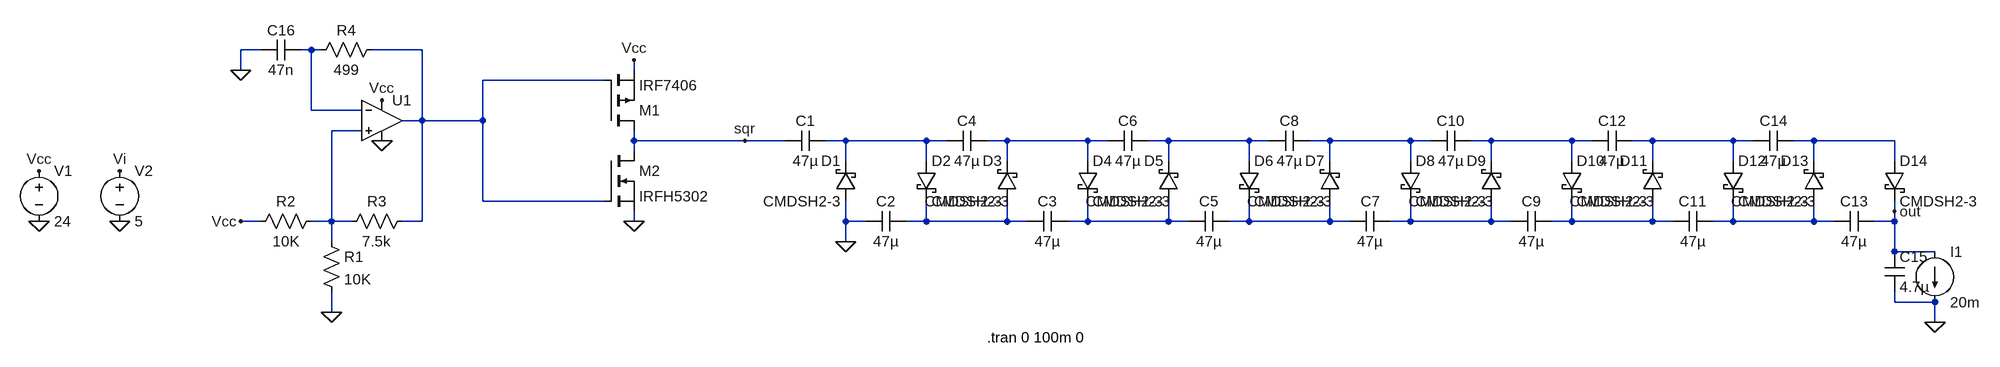
[diagram p0: schematic voltage_mult.asc]
voltage_mult.asc, the LTspice schematic file:
Version 4
SHEET 1 1904 680
WIRE -832 -176 -864 -176
WIRE -752 -176 -768 -176
WIRE -736 -176 -752 -176
WIRE -576 -176 -656 -176
WIRE -864 -144 -864 -176
WIRE -240 -144 -240 -160
WIRE -288 -128 -480 -128
WIRE -752 -80 -752 -176
WIRE -672 -80 -752 -80
WIRE -576 -64 -576 -176
WIRE -576 -64 -608 -64
WIRE -480 -64 -480 -128
WIRE -480 -64 -576 -64
WIRE -672 -48 -720 -48
WIRE -240 -32 -240 -48
WIRE -64 -32 -240 -32
WIRE 0 -32 -64 -32
WIRE 96 -32 64 -32
WIRE 224 -32 96 -32
WIRE 256 -32 224 -32
WIRE 352 -32 320 -32
WIRE 480 -32 352 -32
WIRE 512 -32 480 -32
WIRE 608 -32 576 -32
WIRE 736 -32 608 -32
WIRE 768 -32 736 -32
WIRE 864 -32 832 -32
WIRE 992 -32 864 -32
WIRE 1024 -32 992 -32
WIRE 1120 -32 1088 -32
WIRE 1248 -32 1120 -32
WIRE 1280 -32 1248 -32
WIRE 1376 -32 1344 -32
WIRE 1504 -32 1376 -32
WIRE 1536 -32 1504 -32
WIRE 1632 -32 1600 -32
WIRE 1760 -32 1632 -32
WIRE -240 -16 -240 -32
WIRE 96 0 96 -32
WIRE 224 0 224 -32
WIRE 352 0 352 -32
WIRE 480 0 480 -32
WIRE 608 0 608 -32
WIRE 736 0 736 -32
WIRE 864 0 864 -32
WIRE 992 0 992 -32
WIRE 1120 0 1120 -32
WIRE 1248 0 1248 -32
WIRE 1376 0 1376 -32
WIRE 1504 0 1504 -32
WIRE 1632 0 1632 -32
WIRE 1760 0 1760 -32
WIRE -480 64 -480 -64
WIRE -288 64 -480 64
WIRE 1760 80 1760 64
WIRE -832 96 -864 96
WIRE -720 96 -720 -48
WIRE -720 96 -752 96
WIRE -688 96 -720 96
WIRE -576 96 -576 -64
WIRE -576 96 -608 96
WIRE -240 96 -240 80
WIRE 96 96 96 64
WIRE 128 96 96 96
WIRE 224 96 224 64
WIRE 224 96 192 96
WIRE 352 96 352 64
WIRE 352 96 224 96
WIRE 384 96 352 96
WIRE 480 96 480 64
WIRE 480 96 448 96
WIRE 608 96 608 64
WIRE 608 96 480 96
WIRE 640 96 608 96
WIRE 736 96 736 64
WIRE 736 96 704 96
WIRE 864 96 864 64
WIRE 864 96 736 96
WIRE 896 96 864 96
WIRE 992 96 992 64
WIRE 992 96 960 96
WIRE 1120 96 1120 64
WIRE 1120 96 992 96
WIRE 1152 96 1120 96
WIRE 1248 96 1248 64
WIRE 1248 96 1216 96
WIRE 1376 96 1376 64
WIRE 1376 96 1248 96
WIRE 1408 96 1376 96
WIRE 1504 96 1504 64
WIRE 1504 96 1472 96
WIRE 1632 96 1632 64
WIRE 1632 96 1504 96
WIRE 1664 96 1632 96
WIRE 1760 96 1760 80
WIRE 1760 96 1728 96
WIRE -720 128 -720 96
WIRE 96 128 96 96
WIRE 1760 144 1760 96
WIRE 1824 144 1760 144
WIRE 1760 224 1760 208
WIRE 1824 224 1760 224
WIRE -720 240 -720 208
WIRE 1824 256 1824 224
FLAG -64 -32 sqr
FLAG 96 128 0
FLAG 1760 80 out
FLAG 1824 256 0
FLAG -720 240 0
FLAG -1056 96 0
FLAG -1056 16 Vi
FLAG -640 -96 Vcc
FLAG -640 -32 0
FLAG -864 -144 0
FLAG -864 96 Vcc
FLAG -1184 96 0
FLAG -1184 16 Vcc
FLAG -240 96 0
FLAG -240 -160 Vcc
SYMBOL cap 64 -48 R90
WINDOW 0 0 32 VBottom 2
WINDOW 3 32 32 VTop 2
SYMATTR InstName C1
SYMATTR Value 47µ
SYMBOL schottky 112 64 R180
WINDOW 0 24 64 Left 2
WINDOW 3 24 0 Left 2
SYMATTR InstName D1
SYMATTR Value CMDSH2-3
SYMBOL cap 192 80 R90
WINDOW 0 0 32 VBottom 2
WINDOW 3 32 32 VTop 2
SYMATTR InstName C2
SYMATTR Value 47µ
SYMBOL schottky 208 0 R0
SYMATTR InstName D2
SYMATTR Value CMDSH2-3
SYMBOL schottky 368 64 R180
WINDOW 0 24 64 Left 2
WINDOW 3 24 0 Left 2
SYMATTR InstName D3
SYMATTR Value CMDSH2-3
SYMBOL cap 448 80 R90
WINDOW 0 0 32 VBottom 2
WINDOW 3 32 32 VTop 2
SYMATTR InstName C3
SYMATTR Value 47µ
SYMBOL schottky 464 0 R0
SYMATTR InstName D4
SYMATTR Value CMDSH2-3
SYMBOL cap 320 -48 R90
WINDOW 0 0 32 VBottom 2
WINDOW 3 32 32 VTop 2
SYMATTR InstName C4
SYMATTR Value 47µ
SYMBOL schottky 624 64 R180
WINDOW 0 24 64 Left 2
WINDOW 3 24 0 Left 2
SYMATTR InstName D5
SYMATTR Value CMDSH2-3
SYMBOL cap 704 80 R90
WINDOW 0 0 32 VBottom 2
WINDOW 3 32 32 VTop 2
SYMATTR InstName C5
SYMATTR Value 47µ
SYMBOL schottky 720 0 R0
SYMATTR InstName D6
SYMATTR Value CMDSH2-3
SYMBOL cap 576 -48 R90
WINDOW 0 0 32 VBottom 2
WINDOW 3 32 32 VTop 2
SYMATTR InstName C6
SYMATTR Value 47µ
SYMBOL schottky 880 64 R180
WINDOW 0 24 64 Left 2
WINDOW 3 24 0 Left 2
SYMATTR InstName D7
SYMATTR Value CMDSH2-3
SYMBOL cap 960 80 R90
WINDOW 0 0 32 VBottom 2
WINDOW 3 32 32 VTop 2
SYMATTR InstName C7
SYMATTR Value 47µ
SYMBOL schottky 976 0 R0
SYMATTR InstName D8
SYMATTR Value CMDSH2-3
SYMBOL cap 832 -48 R90
WINDOW 0 0 32 VBottom 2
WINDOW 3 32 32 VTop 2
SYMATTR InstName C8
SYMATTR Value 47µ
SYMBOL schottky 1136 64 R180
WINDOW 0 24 64 Left 2
WINDOW 3 24 0 Left 2
SYMATTR InstName D9
SYMATTR Value CMDSH2-3
SYMBOL cap 1216 80 R90
WINDOW 0 0 32 VBottom 2
WINDOW 3 32 32 VTop 2
SYMATTR InstName C9
SYMATTR Value 47µ
SYMBOL schottky 1232 0 R0
SYMATTR InstName D10
SYMATTR Value CMDSH2-3
SYMBOL cap 1088 -48 R90
WINDOW 0 0 32 VBottom 2
WINDOW 3 32 32 VTop 2
SYMATTR InstName C10
SYMATTR Value 47µ
SYMBOL schottky 1392 64 R180
WINDOW 0 24 64 Left 2
WINDOW 3 24 0 Left 2
SYMATTR InstName D11
SYMATTR Value CMDSH2-3
SYMBOL cap 1472 80 R90
WINDOW 0 0 32 VBottom 2
WINDOW 3 32 32 VTop 2
SYMATTR InstName C11
SYMATTR Value 47µ
SYMBOL schottky 1488 0 R0
SYMATTR InstName D12
SYMATTR Value CMDSH2-3
SYMBOL cap 1344 -48 R90
WINDOW 0 0 32 VBottom 2
WINDOW 3 32 32 VTop 2
SYMATTR InstName C12
SYMATTR Value 47µ
SYMBOL schottky 1648 64 R180
WINDOW 0 24 64 Left 2
WINDOW 3 24 0 Left 2
SYMATTR InstName D13
SYMATTR Value CMDSH2-3
SYMBOL cap 1728 80 R90
WINDOW 0 0 32 VBottom 2
WINDOW 3 32 32 VTop 2
SYMATTR InstName C13
SYMATTR Value 47µ
SYMBOL schottky 1744 0 R0
SYMATTR InstName D14
SYMATTR Value CMDSH2-3
SYMBOL cap 1600 -48 R90
WINDOW 0 0 32 VBottom 2
WINDOW 3 32 32 VTop 2
SYMATTR InstName C14
SYMATTR Value 47µ
SYMBOL cap 1744 144 R0
SYMATTR InstName C15
SYMATTR Value 4.7µ
SYMBOL current 1824 144 R0
WINDOW 123 0 0 Left 0
WINDOW 39 0 0 Left 0
SYMATTR InstName I1
SYMATTR Value 20m
SYMBOL res -736 112 R0
SYMATTR InstName R1
SYMATTR Value 10K
SYMBOL res -736 80 R90
WINDOW 0 0 56 VBottom 2
WINDOW 3 32 56 VTop 2
SYMATTR InstName R2
SYMATTR Value 10K
SYMBOL res -592 80 R90
WINDOW 0 0 56 VBottom 2
WINDOW 3 32 56 VTop 2
SYMATTR InstName R3
SYMATTR Value 7.5k
SYMBOL voltage -1056 0 R0
SYMATTR InstName V2
SYMATTR Value 5
SYMBOL res -640 -192 R90
WINDOW 0 0 56 VBottom 2
WINDOW 3 32 56 VTop 2
SYMATTR InstName R4
SYMATTR Value 499
SYMBOL cap -768 -192 R90
WINDOW 0 0 32 VBottom 2
WINDOW 3 32 32 VTop 2
SYMATTR InstName C16
SYMATTR Value 47n
SYMATTR SpiceLine IC=2
SYMBOL OpAmps\\UniversalOpAmp2 -640 -64 R0
SYMATTR InstName U1
SYMATTR Value2 Avol=1Meg GBW=4Meg Slew=16Meg
SYMBOL pmos -288 -48 M180
SYMATTR InstName M1
SYMATTR Value IRF7406
SYMBOL nmos -288 -16 R0
SYMATTR InstName M2
SYMATTR Value IRFH5302
SYMBOL voltage -1184 0 R0
WINDOW 123 0 0 Left 0
WINDOW 39 0 0 Left 0
SYMATTR InstName V1
SYMATTR Value 24
TEXT 320 280 Left 2 !.tran 0 100m 0

The netlist it stands for:
* voltage_mult.asc
C1 N004 sqr 47µ
D1 0 N004 CMDSH2-3
C2 N011 0 47µ
D2 N004 N011 CMDSH2-3
D3 N011 N005 CMDSH2-3
C3 N012 N011 47µ
D4 N005 N012 CMDSH2-3
C4 N005 N004 47µ
D5 N012 N006 CMDSH2-3
C5 N013 N012 47µ
D6 N006 N013 CMDSH2-3
C6 N006 N005 47µ
D7 N013 N007 CMDSH2-3
C7 N014 N013 47µ
D8 N007 N014 CMDSH2-3
C8 N007 N006 47µ
D9 N014 N008 CMDSH2-3
C9 N015 N014 47µ
D10 N008 N015 CMDSH2-3
C10 N008 N007 47µ
D11 N015 N009 CMDSH2-3
C11 N016 N015 47µ
D12 N009 N016 CMDSH2-3
C12 N009 N008 47µ
D13 N016 N010 CMDSH2-3
C13 out N016 47µ
D14 N010 out CMDSH2-3
C14 N010 N009 47µ
C15 out 0 4.7µ
I1 out 0 20m
R1 N003 0 10K
R2 N003 Vcc 10K
R3 N002 N003 7.5k
V2 Vi 0 5
R4 N002 N001 499
C16 N001 0 47n IC=2
XU1 N003 N001 Vcc 0 N002 level2 Avol=1Meg GBW=4Meg Slew=16Meg Ilimit=25m Rail=0 Vos=0 En=0 Enk=0 In=0 Ink=0 Rin=500Meg  ; pins In+ In- V+ V- OUT
M1 sqr N002 Vcc Vcc IRF7406
M2 sqr N002 0 0 IRFH5302
V1 Vcc 0 24
.model D D
.lib standard.dio
.model NMOS NMOS
.model PMOS PMOS
.lib standard.mos
.tran 0 100m 0
.lib UniversalOpAmp2.lib
.backanno
.end